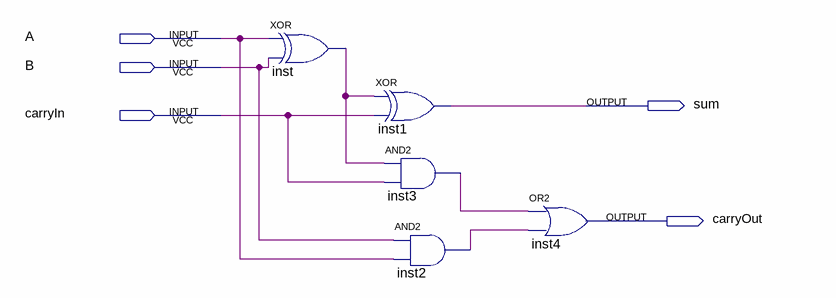
[diagram p0: schematic sheet]
// Quartus schematic fullAdder.bdf as structural Verilog: 5 symbols, 5 pins
module fullAdder (
  input  A,
  input  B,
  input  carryIn,
  output sum,
  output carryOut
);

  wire inst2_out, inst3_out, inst_out;

  xor inst (inst_out, A, B);
  xor inst1 (sum, inst_out, carryIn);
  and inst3 (inst3_out, inst_out, carryIn);
  and inst2 (inst2_out, B, A);
  or inst4 (carryOut, inst3_out, inst2_out);
endmodule
